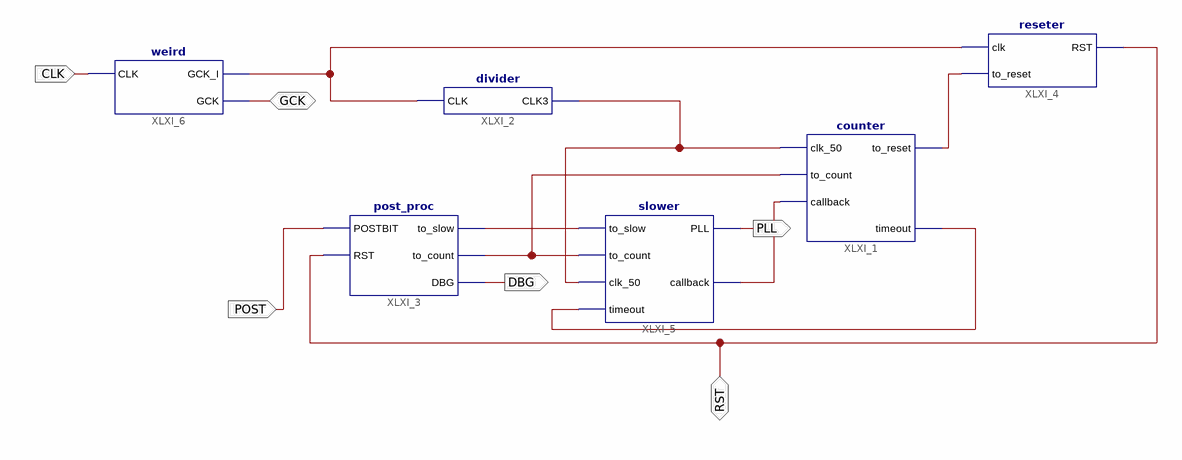
[diagram p0: schematic sheet 1]
// Xilinx ISE schematic overall.sch (xbr) as structural Verilog: 6 symbols, 6 ports
module overall (
  input  CLK,
  input  POST,
  inout  GCK,
  inout  RST,
  output PLL,
  output DBG
);

  wire XLXN_4, XLXN_5, XLXN_59, XLXN_64, XLXN_66, XLXN_68, XLXN_72;

  weird XLXI_6 (.CLK(CLK), .GCK_I(XLXN_72), .GCK(GCK));
  counter XLXI_1 (.clk_50(XLXN_68), .to_count(XLXN_66), .callback(XLXN_4), .to_reset(XLXN_5), .timeout(XLXN_59));
  reseter XLXI_4 (.clk(XLXN_72), .to_reset(XLXN_5), .RST(RST));
  post_proc XLXI_3 (.POSTBIT(POST), .RST(RST), .to_slow(XLXN_64), .to_count(XLXN_66), .DBG(DBG));
  slower XLXI_5 (
    .to_slow(XLXN_64), .to_count(XLXN_66), .clk_50(XLXN_68), .PLL(PLL), .callback(XLXN_4), .timeout(XLXN_59));
  divider XLXI_2 (.CLK(XLXN_72), .CLK3(XLXN_68));
endmodule
